# EAGLE design I2C_Ext (EAGLE 9.6.2)
ABBREV: hb1; PROJECT: Heading Board
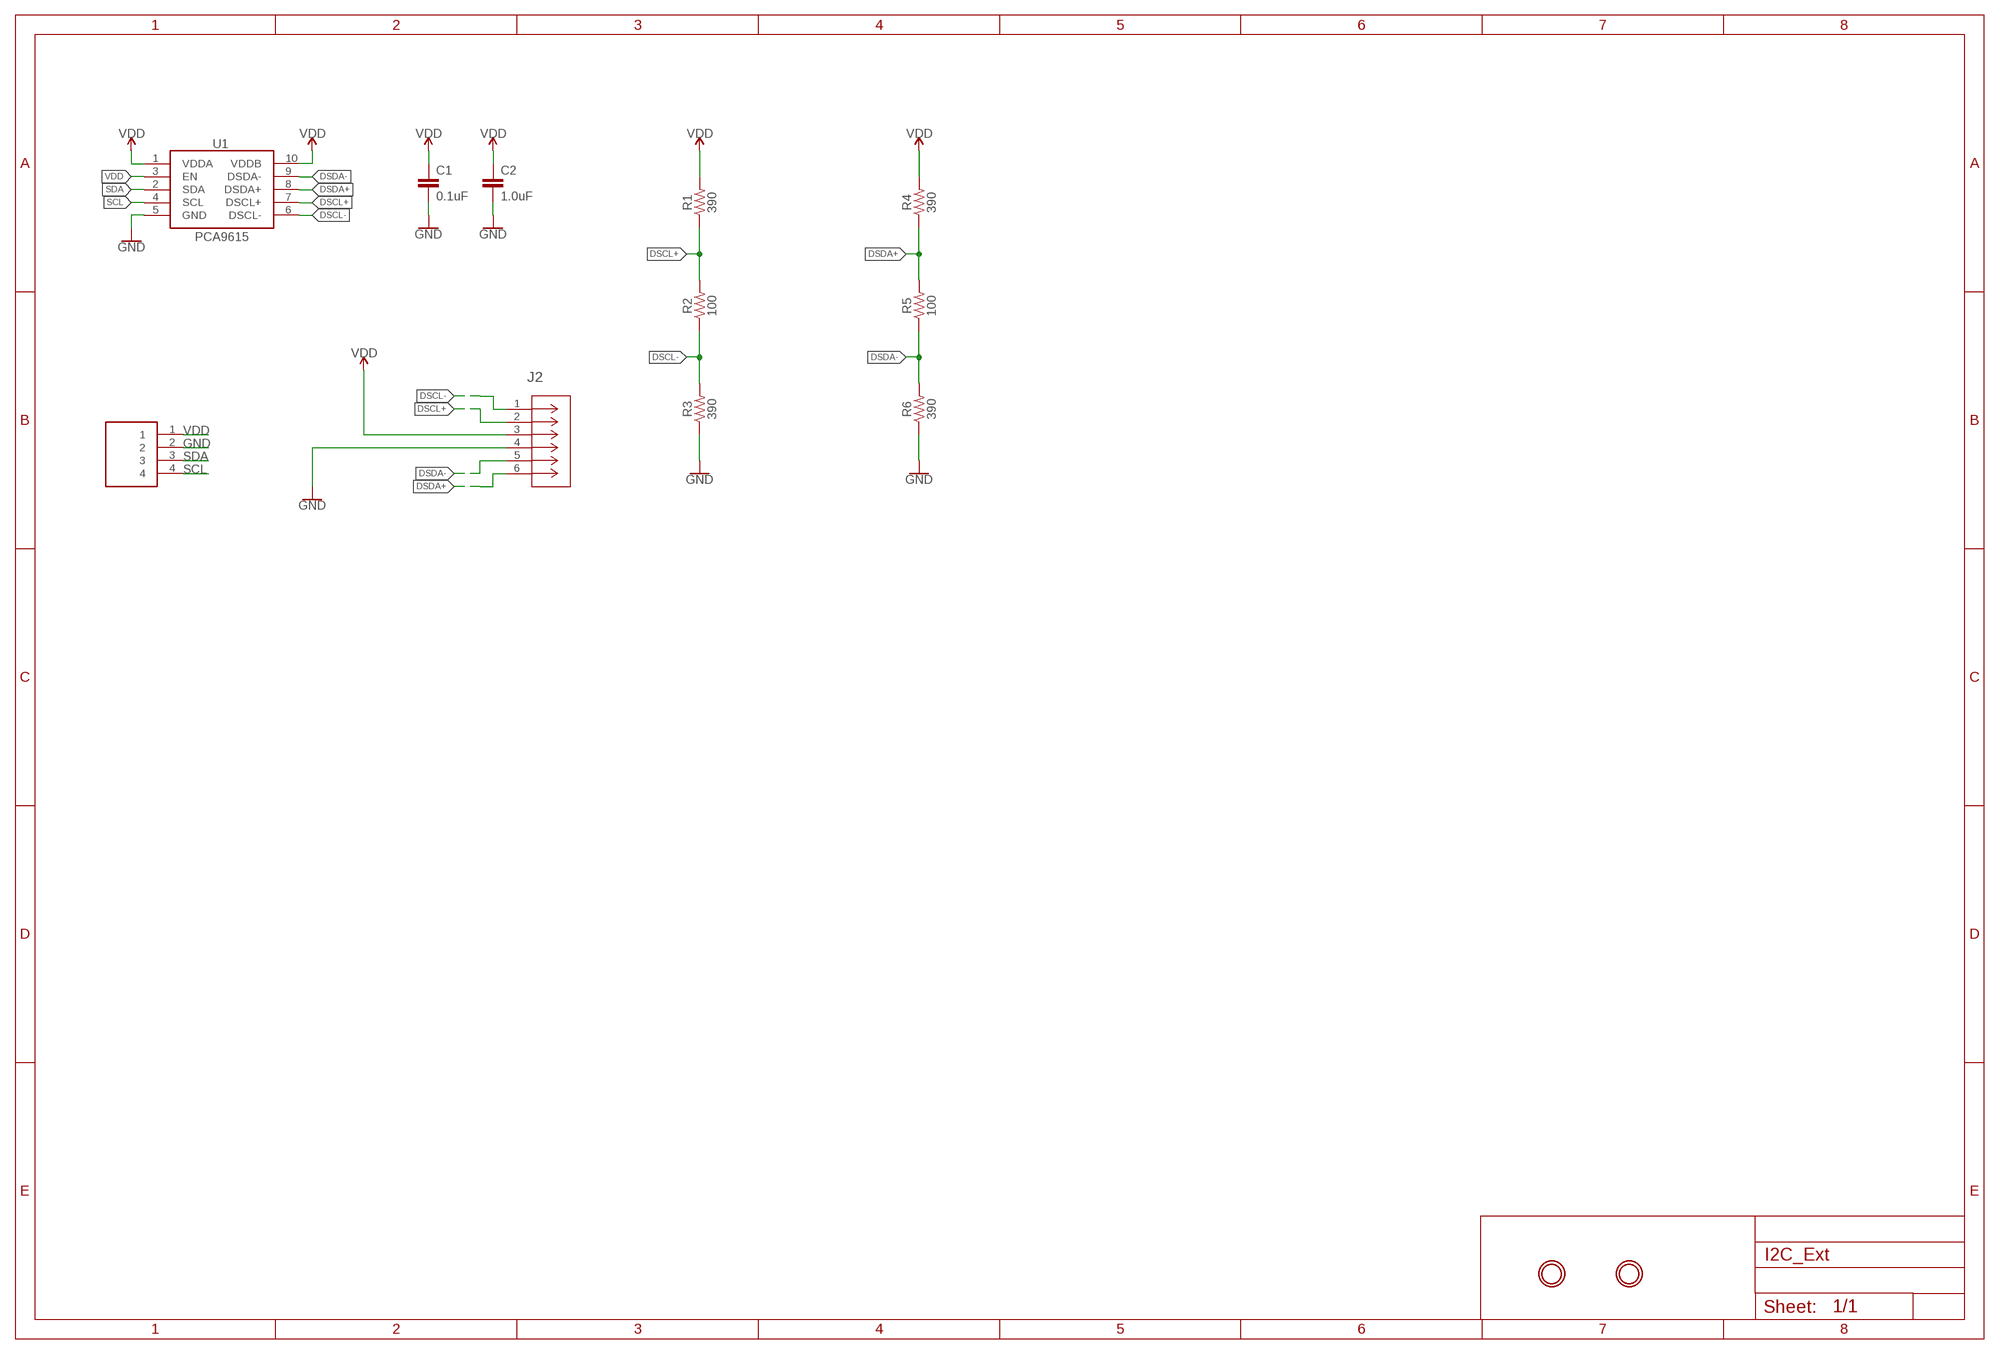
[diagram p0: schematic, sheet 1]

## Parts
C1  0.1uF  0.1UF-0603-25V-(+80/-20%)  [0603]
C2  1.0uF  0.1UF-0603-25V-(+80/-20%)  [0603]
J1  1725672  [1725672]
J2  1725698  [CONN_1725698_PXC]
R1  390  390OHM-0603-1/10W-1%  [0603]
R2  100  100OHM-0603-1/10W-1%  [0603]
R3  390  390OHM-0603-1/10W-1%  [0603]
R4  390  390OHM-0603-1/10W-1%  [0603]
R5  100  100OHM-0603-1/10W-1%  [0603]
R6  390  390OHM-0603-1/10W-1%  [0603]
U1  PCA9615  [TSSOP10]
U$1  MOUNTINGHOLE2.5  [MOUNTINGHOLE_2.5_PLATED]
U$3  MOUNTINGHOLE2.5  [MOUNTINGHOLE_2.5_PLATED]

## Nets
DSCL+: J2.2 R1.1 R2.2 U1.7(DSCL+)
DSCL-: J2.1 R2.1 R3.2 U1.6(DSCL-)
DSDA+: J2.6 R4.1 R5.2 U1.8(DSDA+)
DSDA-: J2.5 R5.1 R6.2 U1.9(DSDA-)
GND: C1.2 C2.2 J1.2 J2.4 R3.1 R6.1 U1.5(GND)
SCL: J1.4 U1.4(SCL)
SDA: J1.3 U1.2(SDA)
VDD: C1.1 C2.1 J1.1 J2.3 R1.2 R4.2 U1.1(VDDA) U1.3(EN) U1.10(VDDB) ; supply symbol labelled VDD_A, VDD_B

## Library data of the parts
C1 = SparkFun-Capacitors:0.1UF: 0.1µF ceramic capacitors A capacitor is a passive two-terminal electrical component used to store electrical energy temporarily in an electric field.; PROD_ID: CAP-00810
C2 = SparkFun-Capacitors:0.1UF: 0.1µF ceramic capacitors A capacitor is a passive two-terminal electrical component used to store electrical energy temporarily in an electric field.; PROD_ID: CAP-00810; VALUE: 0.1uF
J1 = 4pin_screw:1725672: 4 way vertical PCB terminal,6A 63V Phoenix Contact Non-Fused Terminal Block, 4 Way, Solder Terminals, 26 ??? 20 AWG Through Hole, Nylon, 63 V Source: Datasheet <https://datasheet.datasheetarchive.com/originals/distributors/SFDatasheet-2/sf-00050602.pdf>; DESCRIPTION: 4 way vertical PCB terminal,6A 63V Phoenix Contact Non-Fused Terminal Block, 4 Way, Solder Terminals, 26 ??? 20 AWG Through Hole, Nylon, 63 V; HEIGHT: 8.65mm; MANUFACTURER_NAME: Phoenix Contact; MANUFACTURER_PART_NUMBER: 1725672; MOUSER_PART_NUMBER: 651-1725672; MOUSER_PRICE-STOCK: https://www.mouser.co.uk/ProductDetail/Phoenix-Contact/1725672?qs=Ul7CXFMnlWXX93F9bOV2pQ%3D%3D
J2 = 1725698_lib:1725698; COPYRIGHT: Copyright (C) 2023 Ultra Librarian. All rights reserved.; MANUFACTURER_PART_NUMBER: 1725698; MFR_NAME: Phoenix Contact
R1 R3 R4 R6 = SparkFun-Resistors:390OHM: 390Ω resistor A resistor is a passive two-terminal electrical component that implements electrical resistance as a circuit element. Resistors act to reduce current flow, and, at the same time, act to lower voltage levels within circuits. - Wikipedia; PROD_ID: RES-07864
R2 R5 = SparkFun-Resistors:100OHM: 100Ω resistor A resistor is a passive two-terminal electrical component that implements electrical resistance as a circuit element. Resistors act to reduce current flow, and, at the same time, act to lower voltage levels within circuits. - Wikipedia; PROD_ID: RES-07863
U1 = SparkFun-IC-Comms:PCA9615: Differential I2C Bus Buffer Datasheet <https://www.nxp.com/docs/en/data-sheet/PCA9615.pdf>; PROD_ID: IC-13899
U$1 U$3 = microbuilder:MOUNTINGHOLE: Mounting Hole For #2 screws (0.086"/2.18mm width, 0.094"/2.4mm hole) use 2.5mm

## Net classes
0 default: width 0.203 mm
1 power: width 0.381 mm, clearance 0.254 mm

## Board
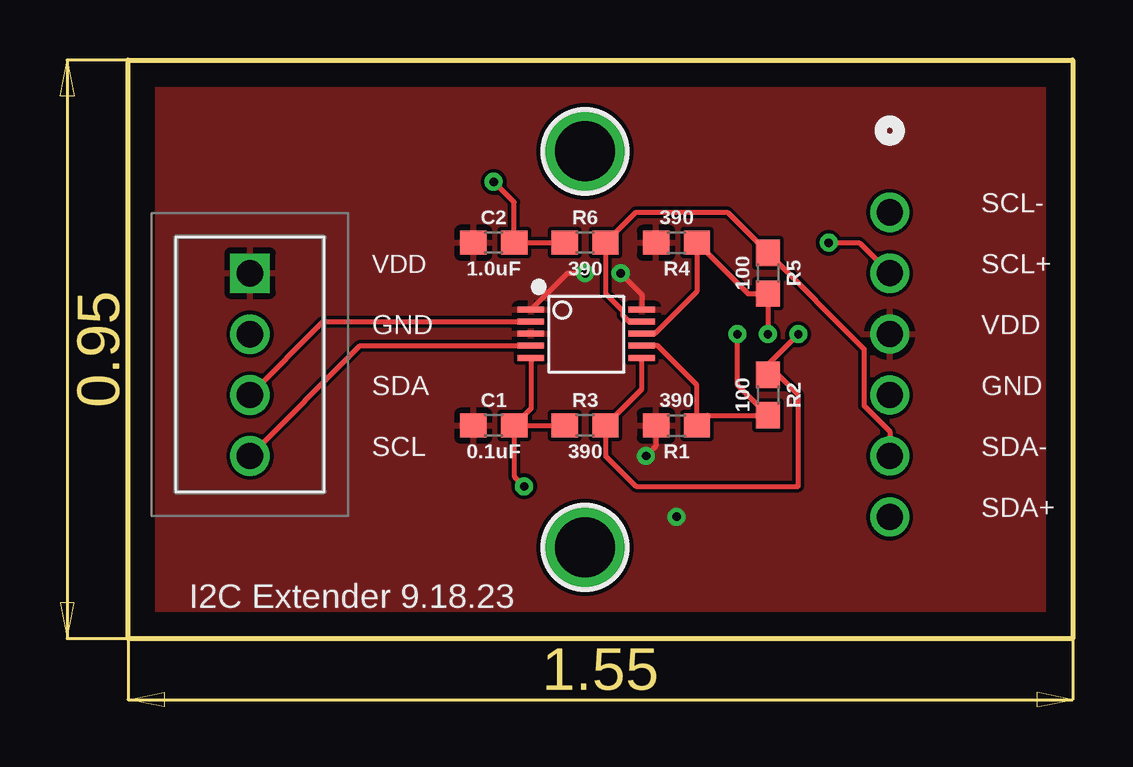
[diagram p1: board, top side]
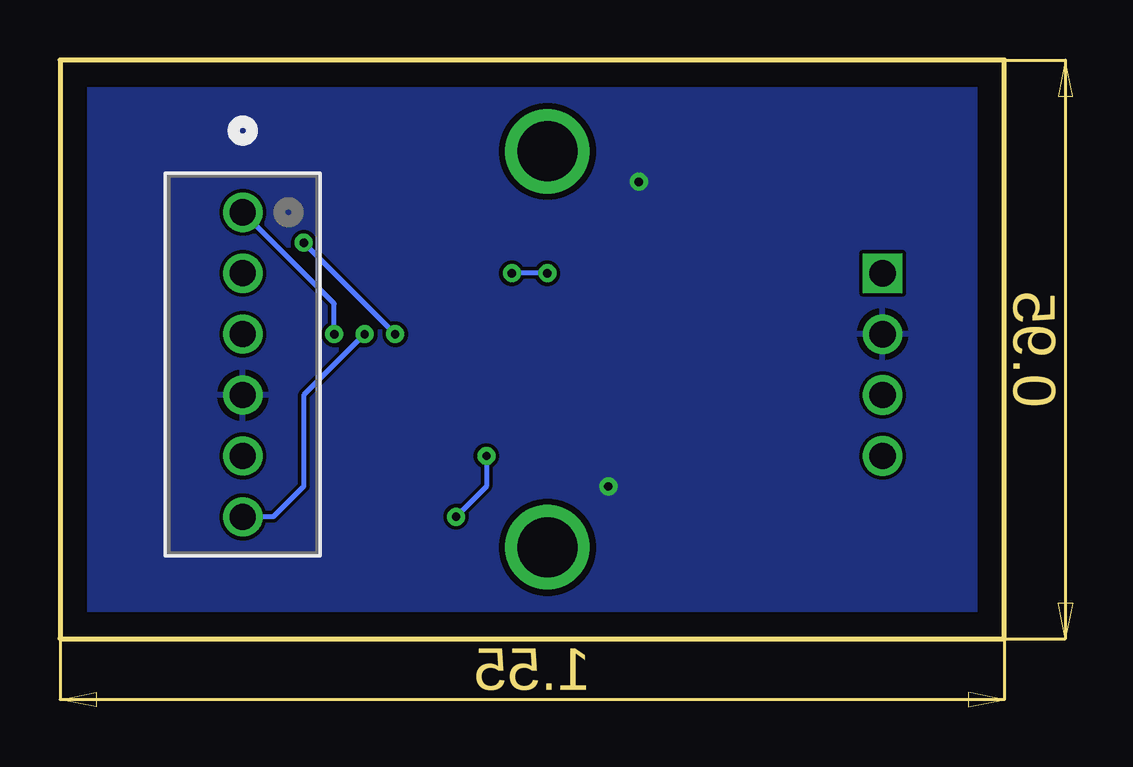
[diagram p2: board, bottom side, seen from below]

Size 39.37 x 24.13 mm. Coordinates in mm from the lower left corner, seen from the top.
Outline: 0,24.13 39.37,24.13 39.37,0 0,0 0,24.13
Copper layers (1*16): Top 0.035mm / dielectric 1.5mm / Bottom 0.035mm
Design rules "default": minimum track width 6mil, minimum drill 0.35mm, track to track 6mil, track to pad 6mil, pad to pad 6mil, via to via 6mil, smd to smd 6mil, copper to edge 40mil, drill to drill 6mil, minimum pad ring 10mil, minimum via ring 8mil, stop-mask expansion 4mil, vias tented up to drill 0mil, thermal gap 10mil

### Footprints (pad centres in the part's own frame; a part is rotated, then mirrored left to right if it is on the bottom)
0603 = smd 1.1 x 1: 1 -0.85,0; 2 0.85,0
1725672 = drill 1.1 pad 1.65 square: 1 0,0 | drill 1.1 pad 1.65: 2 2.54,0; 3 5.08,0; 4 7.62,0
CONN_1725698_PXC = drill 1.092 pad 1.6: 1 0,0; 2 2.54,0; 3 5.08,0; 4 7.62,0; 5 10.16,0; 6 12.7,0
TSSOP10 = smd 1.1 x 0.25: 1 -2.259,1.018; 2 -2.259,0.517; 3 -2.259,0.018; 4 -2.259,-0.482; 5 -2.259,-0.988; 6 2.366,-0.988; 7 2.366,-0.482; 8 2.366,0.018; 9 2.366,0.517; 10 2.366,1.018
MOUNTINGHOLE_2.5_PLATED = drill 2.5 pad 3.2: P$1 0,0

### Placement (x,y rotation side)
C1  15.24,8.89 0 top
C2  15.24,16.51 0 top
J1  5.08,15.24 270 top
J2  31.75,17.78 270 bottom
R1  22.86,8.89 180 top
R2  26.67,10.16 270 top
R3  19.05,8.89 0 top
R4  22.86,16.51 180 top
R5  26.67,15.24 270 top
R6  19.05,16.51 0 top
U1  19.05,12.7 0 top
U$1  19.05,3.81 0 top
U$3  19.05,20.32 0 top

### Tracks (layer width: path | path; a pad name or v marks a point on that pad's centre or on a via)
DSCL+  (via drill 0.35)
  Top 0.203: U1.7 22.07,12.22 23.71,10.58 R1.1 24.13,9.31 R2.2 25.4,10.58 v25.4,12.7 | v29.21,16.51 30.48,16.51 J2.2
  Bottom 0.203: v25.4,12.7 v29.21,16.51
DSCL-  (via drill 0.35)
  Top 0.203: U1.6 21.42,10.41 R3.2 19.9,7.62 21.17,6.35 27.94,6.35 27.94,10.16 27.09,11.01 R2.1 26.67,11.43 v27.94,12.7
  Bottom 0.203: v27.94,12.7 27.94,13.97 J2.1
DSDA+  (via drill 0.35)
  Top 0.203: U1.8 21.44,12.74 21.97,12.74 23.71,14.48 R4.1 25.83,14.39 R5.2 v26.67,12.7
  Bottom 0.203: v26.67,12.7 29.21,10.16 29.21,6.35 30.48,5.08 J2.6
DSDA-
  Top 0.203: J2.5 31.75,8.64 30.68,9.71 30.68,12.08 R5.1 24.98,17.78 21.17,17.78 R6.2 19.9,14.39 20.61,13.68 20.61,13.49 20.88,13.22 U1.9
GND  (via drill 0.35)
  Top 0.203: U1.5 16.79,9.59 C1.2 | C1.2 R3.1 | R6.1 C2.2 16.09,18.2 v15.24,19.05 | C1.2 16.09,6.77 v16.51,6.35
  pour Bottom: 0,24.13 0,0 39.37,0 39.37,24.13
SCL
  Top 0.203: J1.4 9.68,12.22 U1.4
SDA
  Top 0.203: J1.3 8.14,13.22 U1.2
VDD  (via drill 0.35)
  Top 0.203: U1.1 18.31,15.24 v19.05,15.24 | v20.53,15.24 21.42,14.36 U1.10 | R1.2 22.01,8.04 v21.59,7.62
  Bottom 0.203: v19.05,15.24 v20.53,15.24 | v21.59,7.62 21.59,6.35 v22.86,5.08
  pour Top: 0,24.13 39.37,24.13 39.37,0 0,0

### Text on the board
tPlace: I2C Extender 9.18.23
tNames: SCL- | VDD | SCL+ | GND | VDD | SDA | GND | SCL | SDA- | SDA+